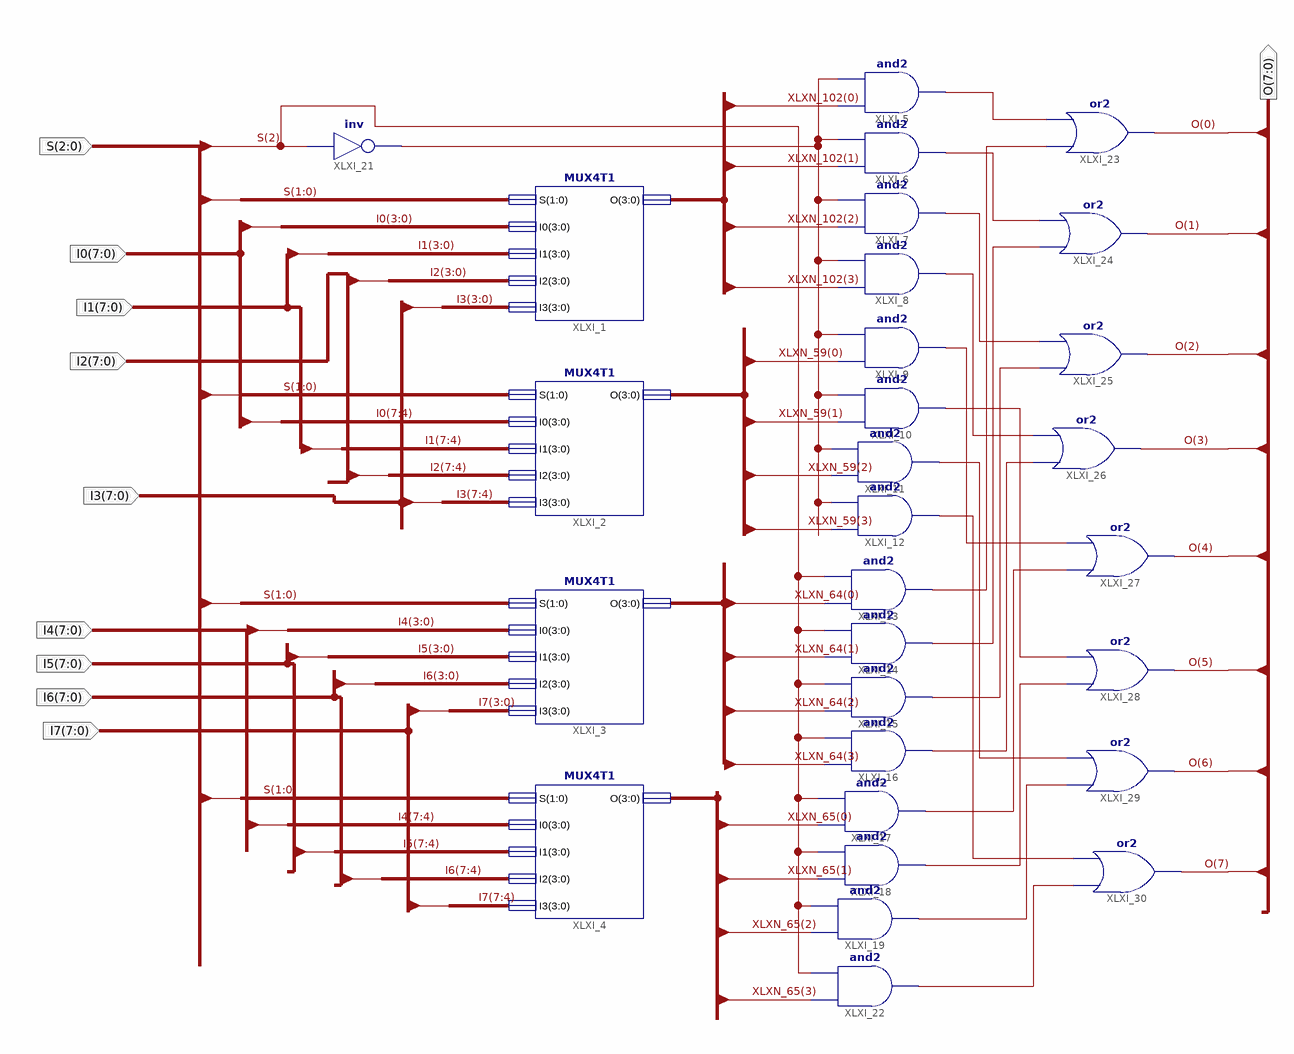
[diagram p0: schematic sheet 1]
// Xilinx ISE schematic MUX8T1_8.sch (kintex7) as structural Verilog: 29 symbols, 10 ports
module MUX8T1_8 (
  input  [2:0] S,
  input  [7:0] I0,
  input  [7:0] I1,
  input  [7:0] I2,
  input  [7:0] I3,
  input  [7:0] I4,
  input  [7:0] I5,
  input  [7:0] I6,
  input  [7:0] I7,
  output [7:0] O
);

  wire XLXN_53, XLXN_76, XLXN_77, XLXN_78, XLXN_79, XLXN_80, XLXN_81, XLXN_82, XLXN_83, XLXN_84, XLXN_85,
       XLXN_86, XLXN_87, XLXN_88, XLXN_89, XLXN_90, XLXN_91;
  wire [3:0] XLXN_59, XLXN_64, XLXN_65, XLXN_102;

  MUX4T1 XLXI_1 (.S(S[1:0]), .I0(I0[3:0]), .I1(I1[3:0]), .I2(I2[3:0]), .I3(I3[3:0]), .O(XLXN_102));
  MUX4T1 XLXI_2 (.S(S[1:0]), .I0(I0[7:4]), .I1(I1[7:4]), .I2(I2[7:4]), .I3(I3[7:4]), .O(XLXN_59));
  MUX4T1 XLXI_3 (.S(S[1:0]), .I0(I4[3:0]), .I1(I5[3:0]), .I2(I6[3:0]), .I3(I7[3:0]), .O(XLXN_64));
  MUX4T1 XLXI_4 (.S(S[1:0]), .I0(I4[7:4]), .I1(I5[7:4]), .I2(I6[7:4]), .I3(I7[7:4]), .O(XLXN_65));
  and XLXI_5 (XLXN_76, XLXN_102[0], XLXN_53);
  and XLXI_6 (XLXN_78, XLXN_102[1], XLXN_53);
  and XLXI_7 (XLXN_80, XLXN_102[2], XLXN_53);
  and XLXI_8 (XLXN_82, XLXN_102[3], XLXN_53);
  and XLXI_9 (XLXN_84, XLXN_59[0], XLXN_53);
  and XLXI_10 (XLXN_86, XLXN_59[1], XLXN_53);
  and XLXI_11 (XLXN_88, XLXN_59[2], XLXN_53);
  and XLXI_12 (XLXN_90, XLXN_59[3], XLXN_53);
  and XLXI_13 (XLXN_77, XLXN_64[0], S[2]);
  and XLXI_14 (XLXN_79, XLXN_64[1], S[2]);
  and XLXI_15 (XLXN_81, XLXN_64[2], S[2]);
  and XLXI_16 (XLXN_83, XLXN_64[3], S[2]);
  and XLXI_17 (XLXN_85, XLXN_65[0], S[2]);
  and XLXI_18 (XLXN_87, XLXN_65[1], S[2]);
  and XLXI_19 (XLXN_89, XLXN_65[2], S[2]);
  not XLXI_21 (XLXN_53, S[2]);
  and XLXI_22 (XLXN_91, XLXN_65[3], S[2]);
  or XLXI_23 (O[0], XLXN_77, XLXN_76);
  or XLXI_24 (O[1], XLXN_79, XLXN_78);
  or XLXI_25 (O[2], XLXN_81, XLXN_80);
  or XLXI_26 (O[3], XLXN_83, XLXN_82);
  or XLXI_27 (O[4], XLXN_85, XLXN_84);
  or XLXI_28 (O[5], XLXN_87, XLXN_86);
  or XLXI_29 (O[6], XLXN_89, XLXN_88);
  or XLXI_30 (O[7], XLXN_91, XLXN_90);
endmodule
